# Altium schematic sheet Transistors.SchDoc
size 420 x 297 mm; SheetNumber: 3; SheetTotal: 4
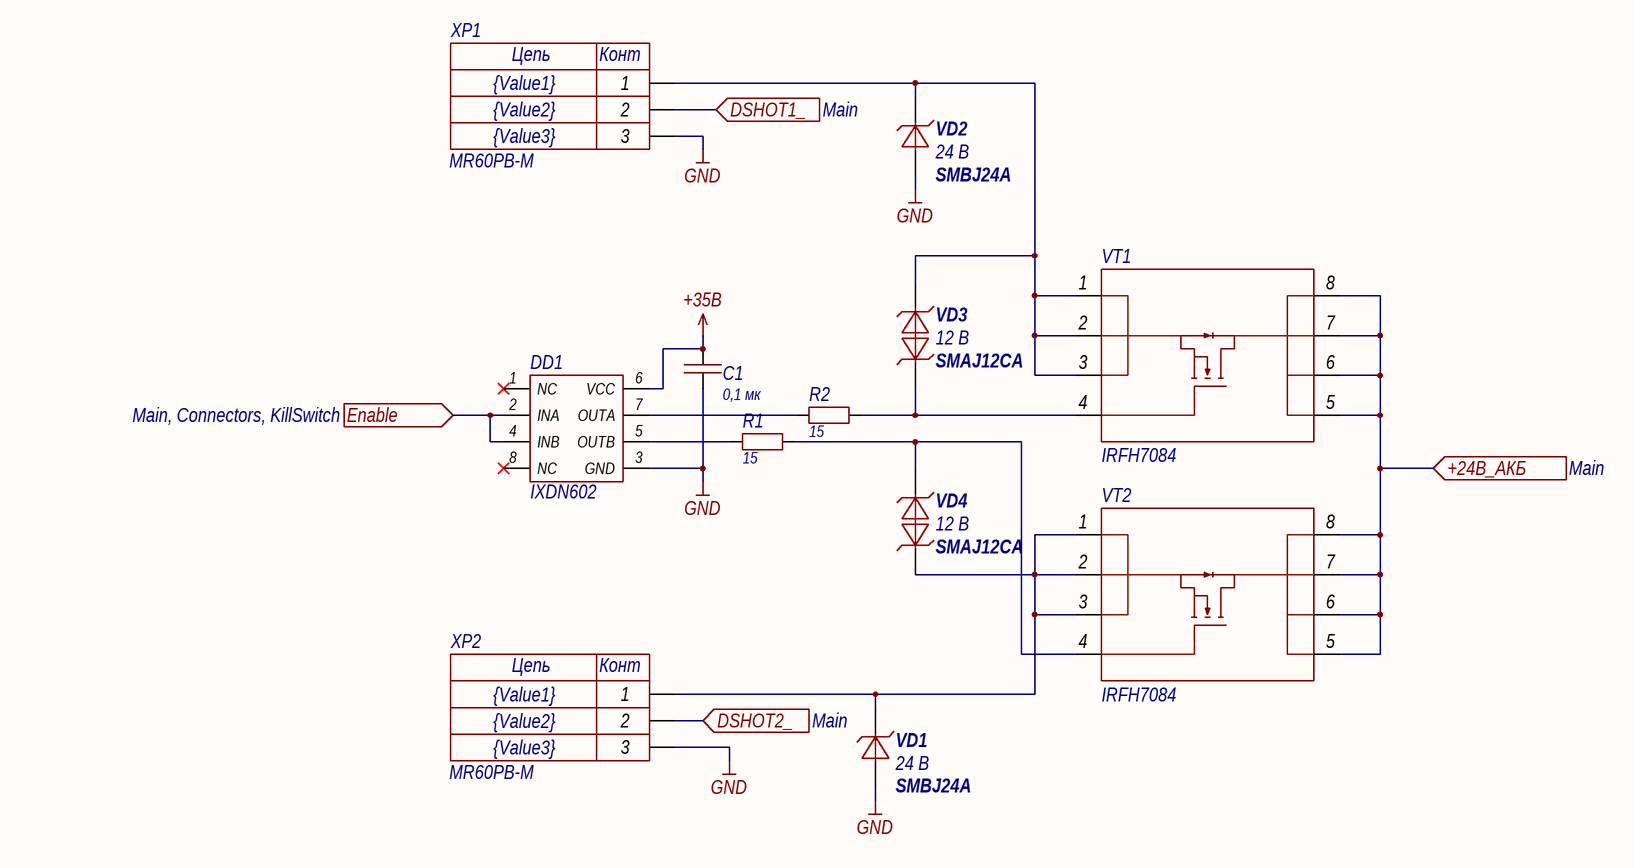
[diagram p0: Transistors.SchDoc]

## Parts
C1  value 0,1 мк  [0603C]  (hidden comment: Capacitor)
DD1  IXDN602  [SOIC-8]
R1  value 15  [0603R]  (hidden comment: Resistor)
R2  value 15  [0603R]  (hidden comment: Resistor)
VD1  SMBJ24A  value 24 В  [SMB]
VD2  SMBJ24A  value 24 В  [SMB]
VD3  SMAJ12CA  value 12 В  [SMA]
VD4  SMAJ12CA  value 12 В  [SMA]
VT1  IRFH7084  [PQFN_5x6]
VT2  IRFH7084  [PQFN_5x6]
XP1  MR60PB-M  Value3: {Value3}  Value2: {Value2}  Value1: {Value1}  [MR60PB-M]
XP2  MR60PB-M  Value3: {Value3}  Value2: {Value2}  Value1: {Value1}  [MR60PB-M]

## Ports
+24В_АКБ (in, see Main), DSHOT1_ (in, see Main), DSHOT2_ (in, see Main), Enable (in, see Main, Connectors, KillSwitch)

## Nets
+35В: C1.2 DD1.6(VCC)
GND: C1.1 DD1.3(GND) VD1.1 VD2.1 XP1.3 XP2.3
+24В_АКБ: VT1.5 VT1.6 VT1.7 VT1.8 VT2.5 VT2.6 VT2.7 VT2.8 ; port +24В_АКБ
DSHOT1_: XP1.2 ; port DSHOT1_
DSHOT2_: XP2.2 ; port DSHOT2_
Enable: DD1.2(INA) DD1.4(INB) ; port Enable
NetDD1_5: DD1.5(OUTB) R1.1
NetDD1_7: DD1.7(OUTA) R2.1
NetR1_2: R1.2 VD4.2 VT2.4
NetR2_2: R2.2 VD3.1 VT1.4
NetVD1_2: VD1.2 VD4.1 VT2.1 VT2.2 VT2.3 XP2.1
NetVD2_2: VD2.2 VD3.2 VT1.1 VT1.2 VT1.3 XP1.1

Not connected (* = marked no-connect by the designer): DD1 1(NC)* 8(NC)*

## Notes on the sheet
- Перв. примен.
- Справ. №
- Подп. и дата
- Инв. № дубл.
- Взам. инв. №
- Инв. № подл.
- Изм.
- Лист
- № докум.
- Подп.
- Дата
- Копировал
- Формат А3
- (in symbol MR60PB-M) Цепь; Конт

## Library data of the parts
C1 = Capacitor_0,1u_10_50V_X7R_0603C: Конденсатор; Library Path2: Schematic\Capacitor.SchLib; Tolerance: 0,1; Voltage (V): 50; Dielectric: X7R; Capacity (nF): 100; Part Number: Capacitor_0,1u_10_50V_X7R_0603C
DD1 = IXDN602: Двухканальный драйвер затвора для mosfet и igbt транзисторов; Part Number: IXDN602
R1 R2 = Resistor_15_1_0603: Резистор номиналом 15 Ом 1%; Power: *; Part Number: Resistor_15_1_0603; Tolerance: 1%
VD1 VD2 = SMBJ24A: Защитный диод на 24 В, рассеиваемая мощность 600 Вт; Voltage nominal (V): 24; Power (W): 600; Part Number: SMBJ24A
VD3 VD4 = SMAJ12CA: Защитный диод на 12 В, рассеиваемая мощность 400 Вт; Voltage nominal (V): 12; Power (W): 400; Part Number: SMAJ12CA
VT1 VT2 = IRFH7084: N-канальный MOSFET; Напряжение С-И/К-Э: 40 В; Ток макс#: 100 А; Part Number: IRFH7084
XP1 XP2 = MR60PB-M: 60 А (40 продолжительно), 3 контакта, прямой отец; System: Connector; Part Number: MR60PB-M